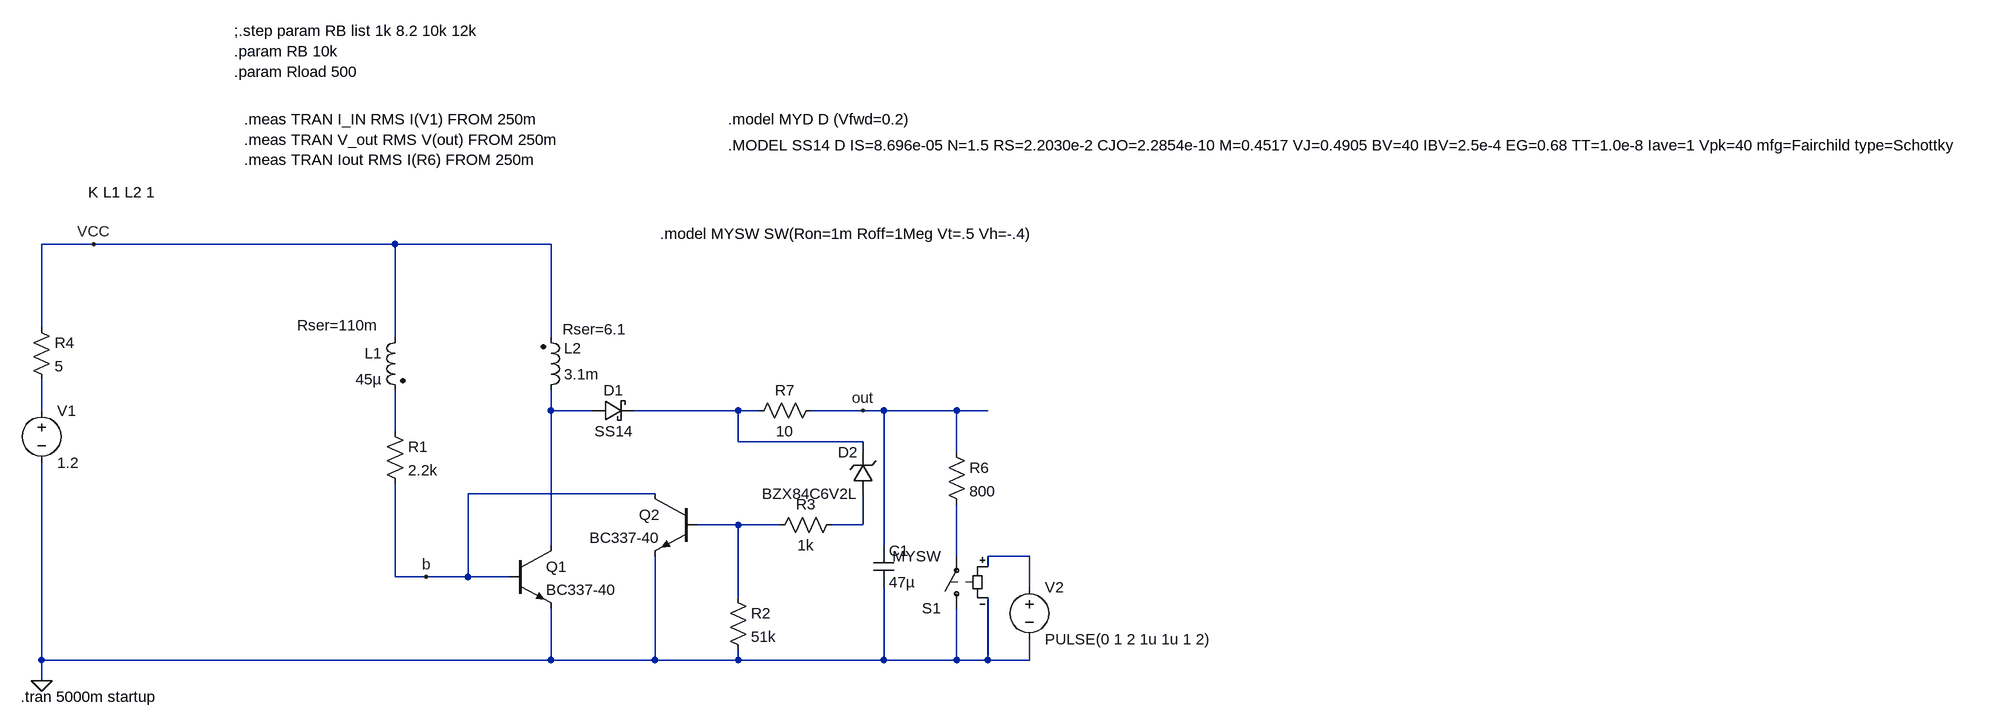
[diagram p0: schematic Night_Lightt.asc]
Night_Lightt.asc, the LTspice schematic file:
Version 4
SHEET 1 3112 680
WIRE 64 -64 -16 -64
WIRE 528 -64 64 -64
WIRE 768 -64 528 -64
WIRE -16 64 -16 -64
WIRE 528 80 528 -64
WIRE 768 80 768 -64
WIRE -16 192 -16 144
WIRE 768 192 768 160
WIRE 832 192 768 192
WIRE 1056 192 896 192
WIRE 1088 192 1056 192
WIRE 1248 192 1168 192
WIRE 1280 192 1248 192
WIRE 1392 192 1280 192
WIRE 1440 192 1392 192
WIRE 528 224 528 160
WIRE 1056 240 1056 192
WIRE 1248 240 1056 240
WIRE 1248 256 1248 240
WIRE 1392 256 1392 192
WIRE 928 320 640 320
WIRE 1056 368 992 368
WIRE 1120 368 1056 368
WIRE 1248 368 1248 320
WIRE 1248 368 1200 368
WIRE 768 400 768 192
WIRE 1280 400 1280 192
WIRE 1392 416 1392 336
WIRE 1504 416 1440 416
WIRE 1440 432 1440 416
WIRE 528 448 528 304
WIRE 576 448 528 448
WIRE 640 448 640 320
WIRE 640 448 576 448
WIRE 704 448 640 448
WIRE 1504 464 1504 416
WIRE 1056 480 1056 368
WIRE -16 576 -16 272
WIRE 768 576 768 496
WIRE 768 576 -16 576
WIRE 928 576 928 416
WIRE 928 576 768 576
WIRE 1056 576 1056 560
WIRE 1056 576 928 576
WIRE 1280 576 1280 464
WIRE 1280 576 1056 576
WIRE 1392 576 1392 496
WIRE 1392 576 1280 576
WIRE 1440 576 1440 480
WIRE 1440 576 1392 576
WIRE 1504 576 1504 544
WIRE 1504 576 1440 576
WIRE -16 608 -16 576
FLAG -16 608 0
FLAG 64 -64 VCC
FLAG 1248 192 out
FLAG 576 448 b
SYMBOL voltage -16 176 R0
WINDOW 123 0 0 Left 0
WINDOW 39 0 0 Left 0
SYMATTR InstName V1
SYMATTR Value 1.2
SYMBOL res 512 208 R0
SYMATTR InstName R1
SYMATTR Value 2.2k
SYMBOL npn 704 400 R0
SYMATTR InstName Q1
SYMATTR Value BC337-40
SYMBOL ind2 544 64 M0
WINDOW 39 41 -3 Left 2
SYMATTR SpiceLine Rser=110m
SYMATTR InstName L1
SYMATTR Value 45µ
SYMATTR Type ind
SYMBOL ind2 752 176 M180
WINDOW 0 36 80 Left 2
WINDOW 3 36 40 Left 2
WINDOW 39 34 109 Left 2
SYMATTR InstName L2
SYMATTR Value 3.1m
SYMATTR SpiceLine Rser=6.1
SYMATTR Type ind
SYMBOL schottky 832 208 R270
WINDOW 0 32 32 VTop 2
WINDOW 3 0 32 VBottom 2
SYMATTR InstName D1
SYMATTR Value SS14
SYMATTR Description Diode
SYMATTR Type diode
SYMBOL cap 1264 400 R0
SYMATTR InstName C1
SYMATTR Value 47µ
SYMATTR SpiceLine Rser=20m
SYMBOL res 1040 464 R0
SYMATTR InstName R2
SYMATTR Value 51k
SYMBOL res 1104 384 R270
WINDOW 0 32 56 VTop 2
WINDOW 3 0 56 VBottom 2
SYMATTR InstName R3
SYMATTR Value 1k
SYMBOL res 1376 240 R0
SYMATTR InstName R6
SYMATTR Value 800
SYMBOL res 1184 176 R90
WINDOW 0 0 56 VBottom 2
WINDOW 3 32 56 VTop 2
SYMATTR InstName R7
SYMATTR Value 10
SYMBOL npn 992 320 M0
SYMATTR InstName Q2
SYMATTR Value BC337-40
SYMBOL zener 1264 320 R180
WINDOW 0 24 64 Left 2
WINDOW 3 24 0 Left 2
SYMATTR InstName D2
SYMATTR Value BZX84C6V2L
SYMATTR Description Diode
SYMATTR Type diode
SYMBOL sw 1392 512 R180
SYMATTR InstName S1
SYMATTR Value MYSW
SYMBOL voltage 1504 448 R0
WINDOW 123 0 0 Left 0
WINDOW 39 0 0 Left 0
SYMATTR InstName V2
SYMATTR Value PULSE(0 1 2 1u 1u 1 2)
SYMBOL res -32 48 R0
SYMATTR InstName R4
SYMATTR Value 5
TEXT 56 -144 Left 2 !K L1 L2 1
TEXT -48 632 Left 2 !.tran 5000m startup
TEXT 280 -392 Left 2 !;.step param RB list 1k 8.2 10k 12k\n.param RB 10k\n.param Rload 500
TEXT 296 -256 Left 2 !.meas TRAN I_IN RMS I(V1) FROM 250m\n.meas TRAN V_out RMS V(out) FROM 250m\n.meas TRAN Iout RMS I(R6) FROM 250m
TEXT 936 -80 Left 2 !.model MYSW SW(Ron=1m Roff=1Meg Vt=.5 Vh=-.4)
TEXT 1040 -256 Left 2 !.model MYD D (Vfwd=0.2)
TEXT 1040 -216 Left 2 !.MODEL SS14 D IS=8.696e-05 N=1.5 RS=2.2030e-2 CJO=2.2854e-10 M=0.4517 VJ=0.4905 BV=40 IBV=2.5e-4 EG=0.68 TT=1.0e-8 Iave=1 Vpk=40 mfg=Fairchild type=Schottky

The netlist it stands for:
* Night_Lightt.asc
V1 N001 0 1.2
R1 N004 b 2.2k
Q1 N002 b 0 0 BC337-40
L1 VCC N004 45µ Rser=110m
L2 N002 VCC 3.1m Rser=6.1
D1 N002 N003 SS14
C1 out 0 47µ Rser=20m
R2 N005 0 51k
R3 N005 N006 1k
R6 out N007 800
R7 out N003 10
Q2 b N005 0 0 BC337-40
D2 N006 N003 BZX84C6V2L
S1 0 N007 N008 0 MYSW
V2 N008 0 PULSE(0 1 2 1u 1u 1 2)
R4 VCC N001 5
.model D D
.lib standard.dio
.model NPN NPN
.model PNP PNP
.lib standard.bjt
K L1 L2 1
.tran 5000m startup
;.step param RB list 1k 8.2 10k 12k
.param RB 10k
.param Rload 500
.meas TRAN I_IN RMS I(V1) FROM 250m
.meas TRAN V_out RMS V(out) FROM 250m
.meas TRAN Iout RMS I(R6) FROM 250m
.model MYSW SW(Ron=1m Roff=1Meg Vt=.5 Vh=-.4)
.model MYD D (Vfwd=0.2)
.MODEL SS14 D IS=8.696e-05 N=1.5 RS=2.2030e-2 CJO=2.2854e-10 M=0.4517 VJ=0.4905 BV=40 IBV=2.5e-4 EG=0.68 TT=1.0e-8 Iave=1 Vpk=40 mfg=Fairchild type=Schottky
.backanno
.end